# EAGLE design Ultrasonic (EAGLE 9.3.0)
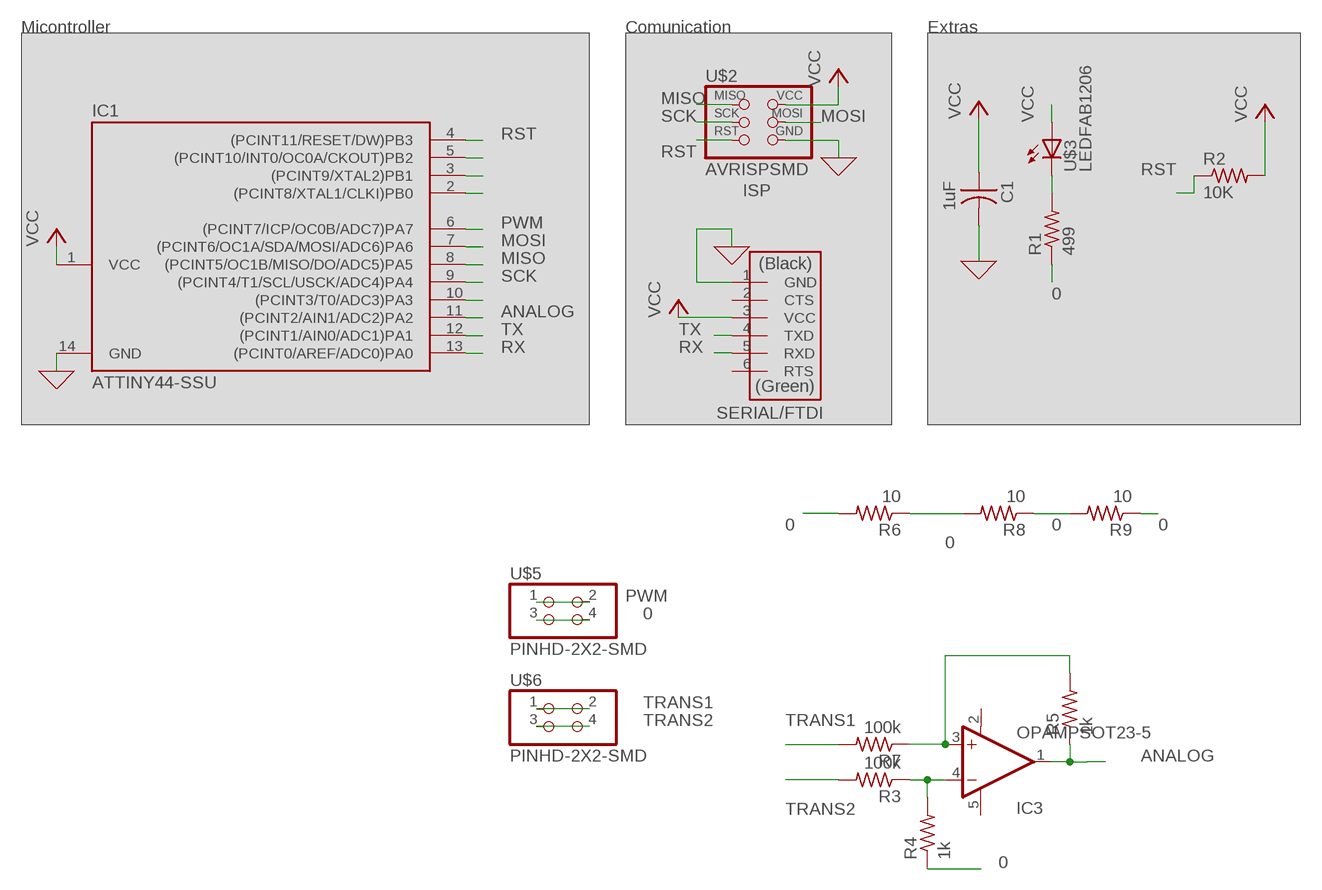
[diagram p0: schematic, sheet 1]

## Parts
C1  1uF  CAP-US1206FAB  [C1206FAB]
IC1  ATTINY44-SSU  [SOIC14]
IC3  OPAMPSOT23-5  [SOT23-5]
R1  499  RES-US1206FAB  [R1206FAB]
R2  10K  RES-US1206FAB  [R1206FAB]
R3  100k  RES-US1206FAB  [R1206FAB]
R4  1k  RES-US1206FAB  [R1206FAB]
R5  1k  RES-US1206FAB  [R1206FAB]
R6  10  RES-US1206FAB  [R1206FAB]
R7  100k  RES-US1206FAB  [R1206FAB]
R8  10  RES-US1206FAB  [R1206FAB]
R9  10  RES-US1206FAB  [R1206FAB]
U$1  FTDI-SMD-HEADER  [1X06SMD]
U$2  AVRISPSMD  [2X03SMD]
U$3  LEDFAB1206  [LED1206FAB]
U$5  PINHD-2X2-SMD  [2X02SMD]
U$6  PINHD-2X2-SMD  [2X02SMD]

## Nets
0: C1.2 IC1.14(GND) R1.1 R4.1 R6.1 R6.2 R8.1 R8.2 R9.1 R9.2 U$1.1(GND) U$2.6(GND) U$5.3 U$5.4 ; supply symbol labelled GND
ANALOG: IC1.11((PCINT2/AIN1/ADC2)PA2) IC3.1(OUT) R5.1
MISO: IC1.8((PCINT5/OC1B/MISO/DO/ADC5)PA5) U$2.1(MISO)
MOSI: IC1.7((PCINT6/OC1A/SDA/MOSI/ADC6)PA6) U$2.4(MOSI)
N$1: R1.2 U$3.2(C)
N$3: IC3.3(+IN) R5.2 R7.1
N$5: IC1.5((PCINT10/INT0/OC0A/CKOUT)PB2)
N$6: IC1.3((PCINT9/XTAL2)PB1)
N$7: IC1.2((PCINT8/XTAL1/CLKI)PB0)
N$11: IC3.4(-IN) R3.1 R4.2
N$12: IC1.10((PCINT3/T0/ADC3)PA3)
PWM: IC1.6((PCINT7/ICP/OC0B/ADC7)PA7) U$5.1 U$5.2
RST: IC1.4((PCINT11/RESET/DW)PB3) R2.1 U$2.5(RST)
RX: IC1.13((PCINT0/AREF/ADC0)PA0) U$1.5(RXD)
SCK: IC1.9((PCINT4/T1/SCL/USCK/ADC4)PA4) U$2.3(SCK)
TRANS1: R7.2 U$6.1 U$6.2
TRANS2: R3.2 U$6.3 U$6.4
TX: IC1.12((PCINT1/AIN0/ADC1)PA1) U$1.4(TXD)
VCC: C1.1 IC1.1(VCC) R2.2 U$1.3(VCC) U$2.2(VCC) U$3.1(A)
Unconnected: U$1.2(CTS) U$1.6(RTS)

## Notes on the sheet
- Micontroller | Comunication | Extras
- ISP
- SERIAL/FTDI

## Power pins joined to a net without a drawn wire
V+: IC3.5(V+)
V-: IC3.2(V-)

## Library data of the parts
C1 = fab:CAP-US
IC1 = fab:ATTINY44
IC3 = fab:OPAMP: Rail-to-Rail Operational Amplifiers Single-Supply, MicroAmplifier(TM) Series
R1-R9 = fab:RES-US: Resistor (US Symbol) Variants with postfix FAB are widened to allow the routing of internal traces
U$1 = fab:FTDI-SMD-HEADER
U$2 = fab:AVRISP
U$3 = fab:LED: LED
U$5 U$6 = fab:PINHD-2X2-SMD

## Board
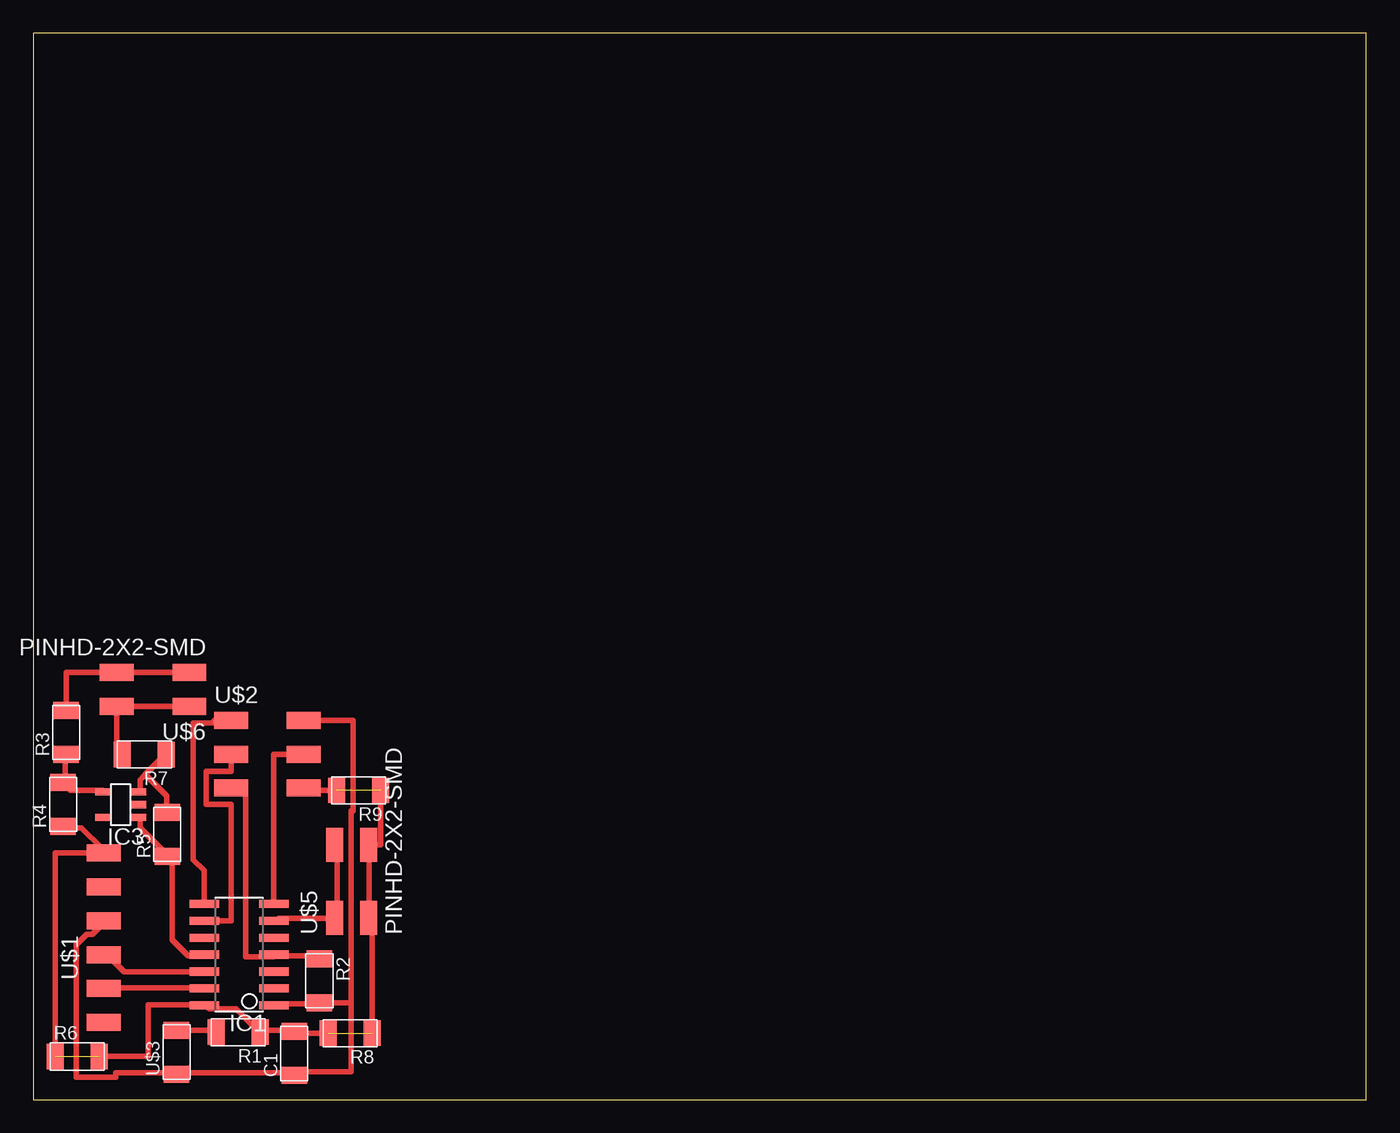
[diagram p1: board, top side]

Size 100 x 80 mm. Coordinates in mm from the lower left corner, seen from the top.
Outline: 0,0 100,0 100,80 0,80 0,0
Copper layers (1*16): Top 0.035mm / dielectric 1.5mm / Bottom 0.035mm
Design rules "default *": minimum track width 0.4mm, minimum drill 0.816609375mm, track to track 0.4mm, track to pad 0.4mm, pad to pad 0.4mm, via to via 0.4mm, smd to smd 0.4mm, copper to edge 40mil, drill to drill 6mil, minimum pad ring 10mil, minimum via ring 8mil, stop-mask expansion 4mil, vias tented up to drill 0mil, thermal gap 10mil

### Footprints (pad centres in the part's own frame; a part is rotated, then mirrored left to right if it is on the bottom)
C1206FAB = smd 1.27 x 1.905: 1 -1.651,0; 2 1.651,0
SOIC14 = smd 0.61 x 2.21: 1 -3.81,-2.603; 2 -2.54,-2.603; 3 -1.27,-2.603; 4 0,-2.603; 5 1.27,-2.603; 6 2.54,-2.603; 7 3.81,-2.603; 8 3.81,2.603; 9 2.54,2.603; 10 1.27,2.603; 11 0,2.603; 12 -1.27,2.603; 13 -2.54,2.603; 14 -3.81,2.603
SOT23-5 = smd 0.533 x 1.194: 1 -0.95,-1.306; 2 0,-1.306; 3 0.95,-1.306; 4 0.95,1.306; 5 -0.95,1.306
R1206FAB = smd 1.27 x 1.905: 1 -1.651,0; 2 1.651,0
1X06SMD = smd 2.54 x 1.27: 1 0,6.35; 2 0,3.81; 3 0,1.27; 4 0,-1.27; 5 0,-3.81; 6 0,-6.35
2X03SMD = smd 2.54 x 1.27: 1 -2.54,2.54; 2 2.92,2.54; 3 -2.54,0; 4 2.92,0; 5 -2.54,-2.54; 6 2.92,-2.54
LED1206FAB = smd 1.27 x 1.905: 1 -1.651,0; 2 1.651,0
2X02SMD = smd 2.54 x 1.27: 1 -2.54,1.27; 2 2.92,1.27; 3 -2.54,-1.27; 4 2.92,-1.27

### Placement (x,y rotation side)
C1  19.58,3.45 90 top
IC1  15.44,10.87 90 top
IC3  6.55,22.12 90 top
R1  15.37,5.05 180 top
R2  21.46,8.92 270 top
R3  10K  [R1206FAB]  2.46,27.53 90 top
R4  10  [R1206FAB]  2.24,22.15 90 top
R5  10  [R1206FAB]  10.06,19.89 90 top
R6  3.3,3.23 0 top
R7  10K  [R1206FAB]  8.33,25.88 180 top
R8  23.77,4.98 180 top
R9  24.41,23.19 180 top
U$1  5.28,12.14 0 top
U$2  17.37,25.91 0 top
U$3  10.74,3.56 90 top
U$5  23.88,16.18 90 top
U$6  9.17,30.76 180 top

### Tracks (layer width: path | path; a pad name or v marks a point on that pad's centre or on a via)
0  (3 unrouted)
  Top 0.4: 12.88,7.03 13.2,6.8 15.2,6.8 16.8,5.2 R1.1 17.2,5.2 19.2,5.2 C1.2 19.58,4.98 R8.2 | 12.88,7.03 IC1.14 | R4.1 2.4,20.4 3.6,20.4 5.2,18.8 U$1.1 1.65,18.49 R6.1 | 25.18,13.85 25.2,14 25.2,18.8 U$5.4 26.06,19.1 R9.1 | 25.18,13.85 U$5.3 | R6.2 8.61,3.23 8.61,7.11 12.88,7.11 12.88,7.03 | R8.1 25.43,13.85 25.18,13.85 | R9.2 20.29,23.19 U$2.6
ANALOG
  Top 0.4: IC3.1 8,21.2 8,20.4 10,18.4 R5.1 10.4,18 10.4,12 11.6,10.8 12.8,10.8 IC1.11
MISO
  Top 0.4: IC1.8 12.8,14.8 12.8,17.2 12,18 12,21.36 12,21.6 12,28.25 13.58,28.25 13.58,28.45 U$2.1
MOSI
  Top 0.4: IC1.7 18.05,25.91 U$2.4
N$1
  Top 0.4: U$3.2 10.8,5.2 13.6,5.2 R1.2
N$3
  Top 0.4: 8.4,24.4 9.6,25.6 R7.1 | 8.4,24.4 8,24 8,23.2 IC3.3 | 8.4,24.4 10,22.8 10,21.6 R5.2
N$11
  Top 0.4: IC3.4 5.2,23.2 2.8,23.2 2.4,23.6 R4.2 2.4,24 2.4,25.6 R3.1
PWM
  Top 0.4: IC1.6 18.4,13.6 22.4,13.6 U$5.1 22.8,14 22.8,18.8 U$5.2
RST
  Top 0.4: R2.1 21.2,10.8 18.4,10.8 IC1.4 18,10.8 18,10.72 15.93,10.72 15.93,23.37 U$2.5
RX
  Top 0.4: IC1.13 12.8,8.4 5.6,8.4 U$1.5
SCK
  Top 0.4: IC1.9 14.83,13.41 14.83,22.13 12.96,22.13 12.96,24.6 14.83,24.6 U$2.3
TRANS1
  Top 0.4: U$6.1 U$6.2 6.25,25.88 R7.2
TRANS2
  Top 0.4: R3.2 2.46,32.03 U$6.4 U$6.3
TX
  Top 0.4: IC1.12 12.8,9.6 6.8,9.6 5.6,10.8 U$1.4
VCC
  Top 0.4: IC1.1 18.4,7.2 21.2,7.2 R2.2 23.84,7.26 | U$1.3 5.2,13.2 4.4,12.4 4,12.4 3.2,11.6 3.2,1.67 6.19,1.67 6.19,2 10.4,2 U$3.1 10.8,2 19.2,2 C1.1 19.58,2.08 23.84,2.08 23.84,7.26 | 23.84,7.26 23.84,21.64 23.99,21.64 23.99,28.45 U$2.2